# EAGLE design MCU_Power_PCB_Rev1 (EAGLE 9.6.2)
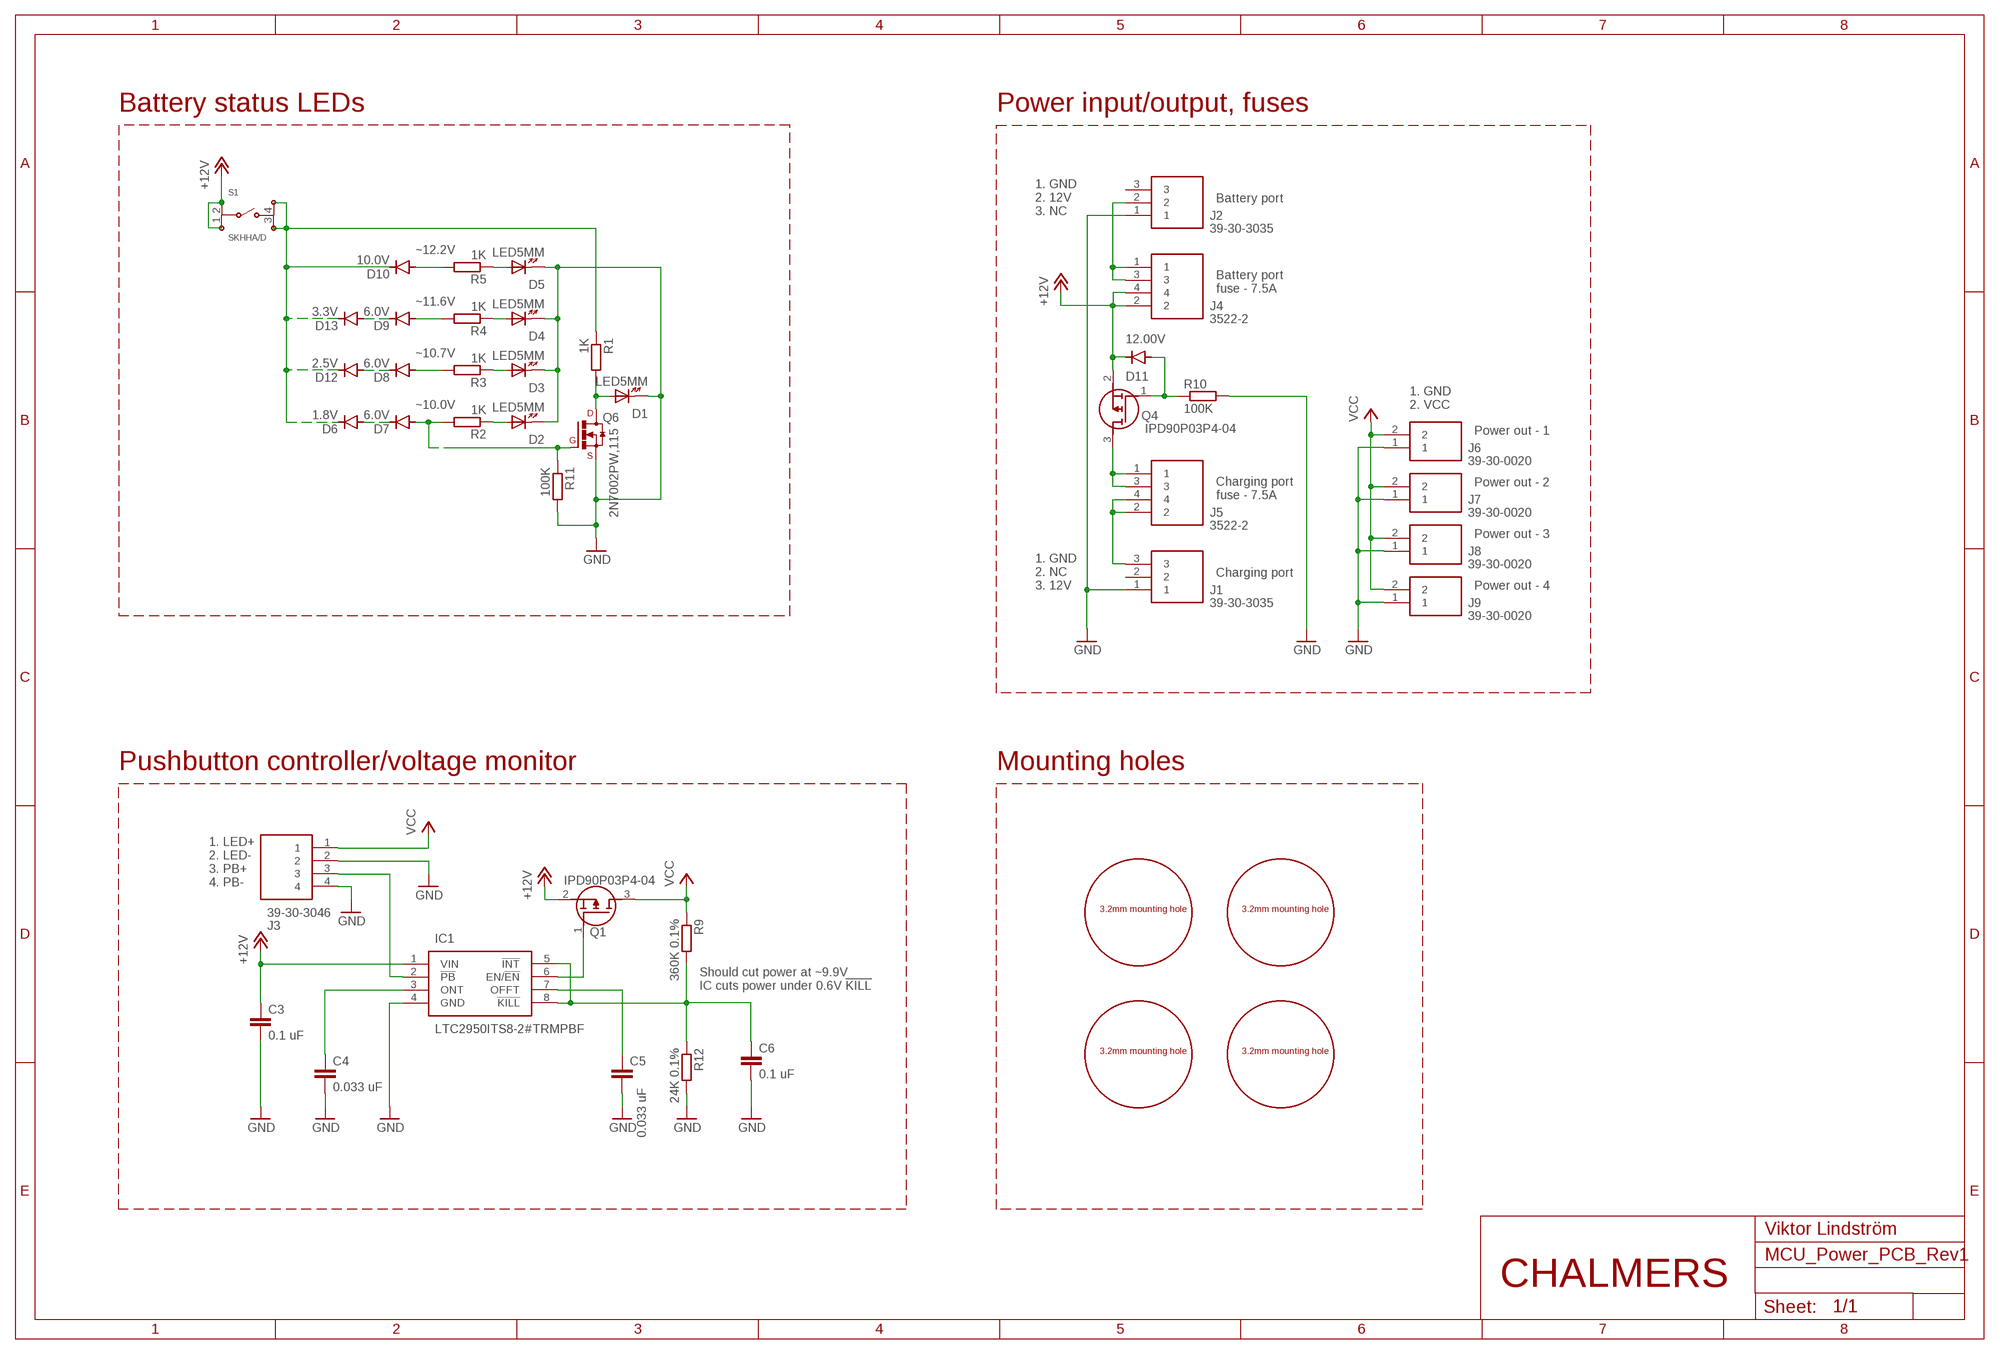
[diagram p0: schematic, sheet 1]

## Parts
C3  0.1 uF  C0603  [C0603]
C4  0.033 uF  C0603  [C0603]
C5  0.033 uF  C0603  [C0603]
C6  0.1 uF  C0603  [C0603]
D1  LED5MM  [LED5MM]
D2  LED5MM  [LED5MM]
D3  LED5MM  [LED5MM]
D4  LED5MM  [LED5MM]
D5  LED5MM  [LED5MM]
D6  1.8V  CGRM4001-G  [SOD-123_MINI-SMA]
D7  6.0V  CGRM4001-G  [SOD-123_MINI-SMA]
D8  6.0V  CGRM4001-G  [SOD-123_MINI-SMA]
D9  6.0V  CGRM4001-G  [SOD-123_MINI-SMA]
D10  10.0V  CGRM4001-G  [SOD-123_MINI-SMA]
D11  12.00V  CGRM4001-G  [SOD-123_MINI-SMA]
D12  2.5V  CGRM4001-G  [SOD-123_MINI-SMA]
D13  3.3V  CGRM4001-G  [SOD-123_MINI-SMA]
HOLE1  M3_MOUNTING_HOLE  [M3_MOUNTING_HOLE]
HOLE2  M3_MOUNTING_HOLE  [M3_MOUNTING_HOLE]
HOLE3  M3_MOUNTING_HOLE  [M3_MOUNTING_HOLE]
HOLE4  M3_MOUNTING_HOLE  [M3_MOUNTING_HOLE]
IC1  LTC2950ITS8-2#TRMPBF  [SOT65P280X100-8N]
J1  39-30-3035  [39303035]
J2  39-30-3035  [39303035]
J3  39-30-3046  [39303046]
J4  3522-2  [35222]
J5  3522-2  [35222]
J6  39-30-0020  [39-30-1020_1]
J7  39-30-0020  [39-30-1020_1]
J8  39-30-0020  [39-30-1020_1]
J9  39-30-0020  [39-30-1020_1]
Q1  IPD90P03P4-04  [PG-TO252-3-11]
Q4  IPD90P03P4-04  [PG-TO252-3-11]
Q6  2N7002PW,115  [SOT323]
R1  1K  R0603  [R0603]
R2  1K  R0603  [R0603]
R3  1K  R0603  [R0603]
R4  1K  R0603  [R0603]
R5  1K  R0603  [R0603]
R9  360K 0.1%  R0603  [R0603]
R10  100K  R0603  [R0603]
R11  100K  R0603  [R0603]
R12  24K 0.1%  R0603  [R0603]
S1  SKHHA/D  [SKHHA/D]

## Nets
+12V: C3.1 D11.C IC1.1(VIN) J4.2 J4.4 Q1.2(S) Q4.2(S) S1.1 S1.2
GND: C3.2 C4.2 C5.2 C6.2 D1.K D2.K D3.K D4.K D5.K IC1.4(GND) J1.1 J2.1 J3.2 J3.4 J6.1 J7.1 J8.1 J9.1 Q6.2(S) R10.2 R11.2 R12.2
N$1: J5.1 J5.3 Q4.3(D)
N$2: C4.1 IC1.3(ONT)
N$3: D2.A R2.1
N$4: D7.A Q6.1(G) R2.2 R11.1
N$5: D8.A R3.2
N$6: D9.A R4.2
N$7: D10.A R5.2
N$8: D3.A R3.1
N$9: D4.A R4.1
N$10: D5.A R5.1
N$11: IC1.2(!PB) J3.3
N$12: D1.A Q6.3(D) R1.2
N$14: J2.2 J4.1 J4.3
N$15: D6.A D7.C
N$16: D6.C D10.C D12.C D13.C R1.1 S1.3 S1.4
N$17: C5.1 IC1.7(OFFT)
N$18: J1.3 J5.2 J5.4
N$19: D8.C D12.A
N$20: D11.A Q4.1(G) R10.1
N$21: D9.C D13.A
N$24: C6.1 IC1.5(!INT) IC1.8(!KILL) R9.2 R12.1
N$25: IC1.6(EN/!EN) Q1.1(G)
VCC: J3.1 J6.2 J7.2 J8.2 J9.2 Q1.3(D) R9.1
Unconnected: J1.2 J2.3

## Notes on the sheet
- Battery status LEDs | Power input/output, fuses
- Battery port
- 1. GND
  2. 12V
  3. NC
- ~12.2V
- Battery port
  fuse - 7.5A
- ~11.6V
- ~10.7V
- ~10.0V
- 1. GND
  2. VCC
- Power out - 1
- Power out - 2
- Charging port
  fuse - 7.5A
- Power out - 3
- Charging port
- 1. GND
  2. NC
  3. 12V
- Power out - 4
- Pushbutton controller/voltage monitor | Mounting holes
- 1. LED+
  2. LED-
  3. PB+
  4. PB-
- Should cut power at ~9.9V
  IC cuts power under 0.6V !KILL
- Viktor Lindström
- CHALMERS

## Library data of the parts
C3-C6 = CASE-RCL:C0603: Standard Chip CAPACITOR 0605 (1608 Metric) Description: Standard Chip CAPACITOR 0605 (1608 Metric)
D1-D5 = CASE-LED:LED5MM: LED 5mm (TH) Description: Standard 5mm TH LED
D6-D13 = diode:CGRM400*-G: Molded plasitc,JEDEC SOD-123/Mini SMA Source: Comchip CGRM4001-G.pdf
HOLE1-HOLE4 = RescueRunner:M3_MOUNTING_HOLE
IC1 = LTC2950ITS8-2#TRMPBF:LTC2950ITS8-2#TRMPBF: Linear Technology LTC2950ITS8-2#TRMPBF, Voltage Controller 1V max., 8-Pin TSOT-23 Source: Datasheet <http://uk.rs-online.com/web/p/products/8225976P>; DESCRIPTION: Linear Technology LTC2950ITS8-2#TRMPBF, Voltage Controller 1V max., 8-Pin TSOT-23; HEIGHT: 1mm; MANUFACTURER_NAME: Linear Technology; MANUFACTURER_PART_NUMBER: LTC2950ITS8-2#TRMPBF; RS_PART_NUMBER: 8225976P; RS_PRICE-STOCK: http://uk.rs-online.com/web/p/products/8225976P
J1 J2 = 39-30-3035:39-30-3035: Molex Mini-Fit Jr 5569, 3 Way, 1 Row, Right Angle PCB Header Source: Datasheet <http://uk.rs-online.com/web/p/products/6705849P>; ALLIED_NUMBER: 70266945; DESCRIPTION: Molex Mini-Fit Jr 5569, 3 Way, 1 Row, Right Angle PCB Header; HEIGHT: 5.8mm; MANUFACTURER_NAME: Molex; MANUFACTURER_PART_NUMBER: 39-30-3035; RS_PART_NUMBER: 6705849P; RS_PRICE-STOCK: http://uk.rs-online.com/web/p/products/6705849P
J3 = 39-30-3046:39-30-3046: Molex MINI-FIT JR. Series, Series Number 5569, 4.2mm Pitch 4 Way 1 Row Right Angle PCB Header, Solder Termination, 12A Source: Datasheet <http://uk.rs-online.com/web/p/products/6705859P>; ALLIED_NUMBER: 70374137; DESCRIPTION: Molex MINI-FIT JR. Series, Series Number 5569, 4.2mm Pitch 4 Way 1 Row Right Angle PCB Header, Solder Termination, 12A; HEIGHT: 6.18mm; MANUFACTURER_NAME: Molex; MANUFACTURER_PART_NUMBER: 39-30-3046; RS_PART_NUMBER: 6705859P; RS_PRICE-STOCK: http://uk.rs-online.com/web/p/products/6705859P
J4 J5 = 3522-2:3522-2: Double ATO 257 fuseholder,15A 500Vac Keystone 15A PCB Mount Fuse Holder for 5.2 x 0.64mm Automotive Fuse, 500 V ac Source: Datasheet <http://uk.rs-online.com/web/p/products/1676068>; ALLIED_NUMBER: 70181615; DESCRIPTION: Double ATO 257 fuseholder,15A 500Vac Keystone 15A PCB Mount Fuse Holder for 5.2 x 0.64mm Automotive Fuse, 500 V ac; HEIGHT: 8mm; MANUFACTURER_NAME: Keystone Electronics; MANUFACTURER_PART_NUMBER: 3522-2; RS_PART_NUMBER: 1676068; RS_PRICE-STOCK: http://uk.rs-online.com/web/p/products/1676068
J6-J9 = 39-30-0020:39-30-0020: MOLEX - 39-30-0020 - HEADER, MINI-FIT, R/A, DUAL ROW, 2WAY Source: Datasheet <http://uk.rs-online.com/web/p/products/6705708P>; ALLIED_NUMBER: 70266919; DESCRIPTION: MOLEX - 39-30-0020 - HEADER, MINI-FIT, R/A, DUAL ROW, 2WAY; HEIGHT: mm; MANUFACTURER_NAME: Molex; MANUFACTURER_PART_NUMBER: 39-30-0020; RS_PART_NUMBER: 6705708P; RS_PRICE-STOCK: http://uk.rs-online.com/web/p/products/6705708P
Q1 Q4 = IPD90P03P4-04:IPD90P03P4-04: MOSFET P-Channel 30V 90A TO252-3 Infineon IPD90P03P4-04 P-channel MOSFET Transistor, 90 A, 30 V, 3-Pin TO-252 Source: Datasheet <https://www.infineon.com/dgdl/Infineon-IPD90P03P4_04-DS-v01_00-en.pdf?fileId=db3a30431ddc9372011e07ecafdb27ed>; DESCRIPTION: MOSFET P-Channel 30V 90A TO252-3 Infineon IPD90P03P4-04 P-channel MOSFET Transistor, 90 A, 30 V, 3-Pin TO-252; HEIGHT: mm; MANUFACTURER_NAME: Infineon; MANUFACTURER_PART_NUMBER: IPD90P03P4-04
Q6 = CASE-Transistors:2N7002PW,115: 2N7002PW,115 N-Channel Mosfet (SOT-323) Description: 2N7002PW,115 N-Channel Mosfet in a SOT-323 (SC-70) package Links: 2N7002PW,115 <http://www.farnell.com/datasheets/1760698.pdf?_ga=2.3009012.510093211.1546607516-411290609.1543318711>
R1-R5 R9-R12 = CASE-RCL:R0603: Standard Chip RESISTOR 0603 (1608 Metric) Description: Standard Chip RESISTOR 0603 (1608 Metric)
S1 = CASE-Switches:SKHHA/D: ALPS SKHHA/D Tactile SPST switches (DIP) Description: ALPS SKHHA/D Tactile SPST switches in DIP package. Links: SKHHAJA010 <http://www.farnell.com/datasheets/1685516.pdf?_ga=2.249631877.2071720333.1546461288-1112771566.1525371275> SKHHARA010 <http://www.farnell.com/datasheets/1685516.pdf?_ga=2.249631877.2071720333.1546461288-1112771566.1525371275> SKHHAPA010 <http://www.farnell.com/datasheets/1582298.pdf?_ga=2.236523650.2071720333.1546461288-1112771566.1525371275> SKHHDUA010 <http://www.farnell.com/datasheets/1582310.pdf?_ga=2.236523650.2071720333.1546461288-1112771566.1525371275>

## Board
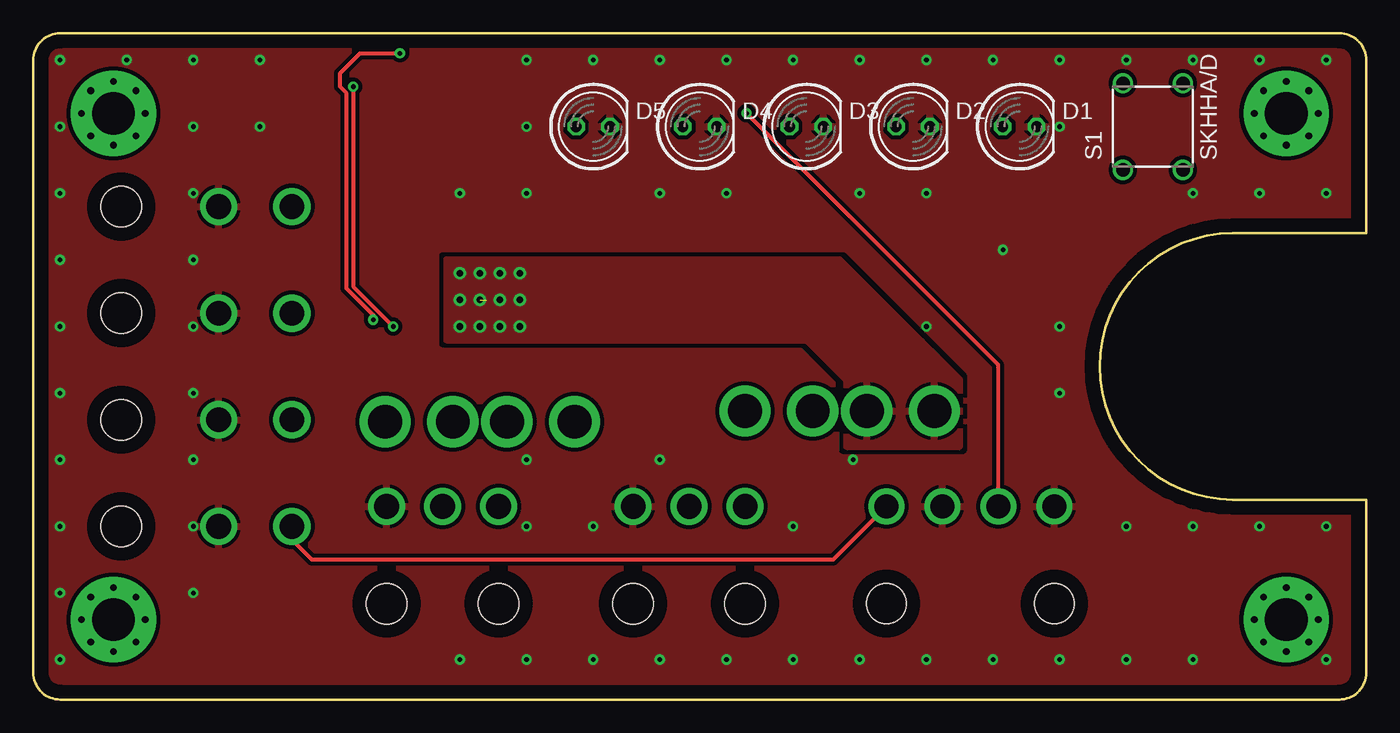
[diagram p1: board, top side]
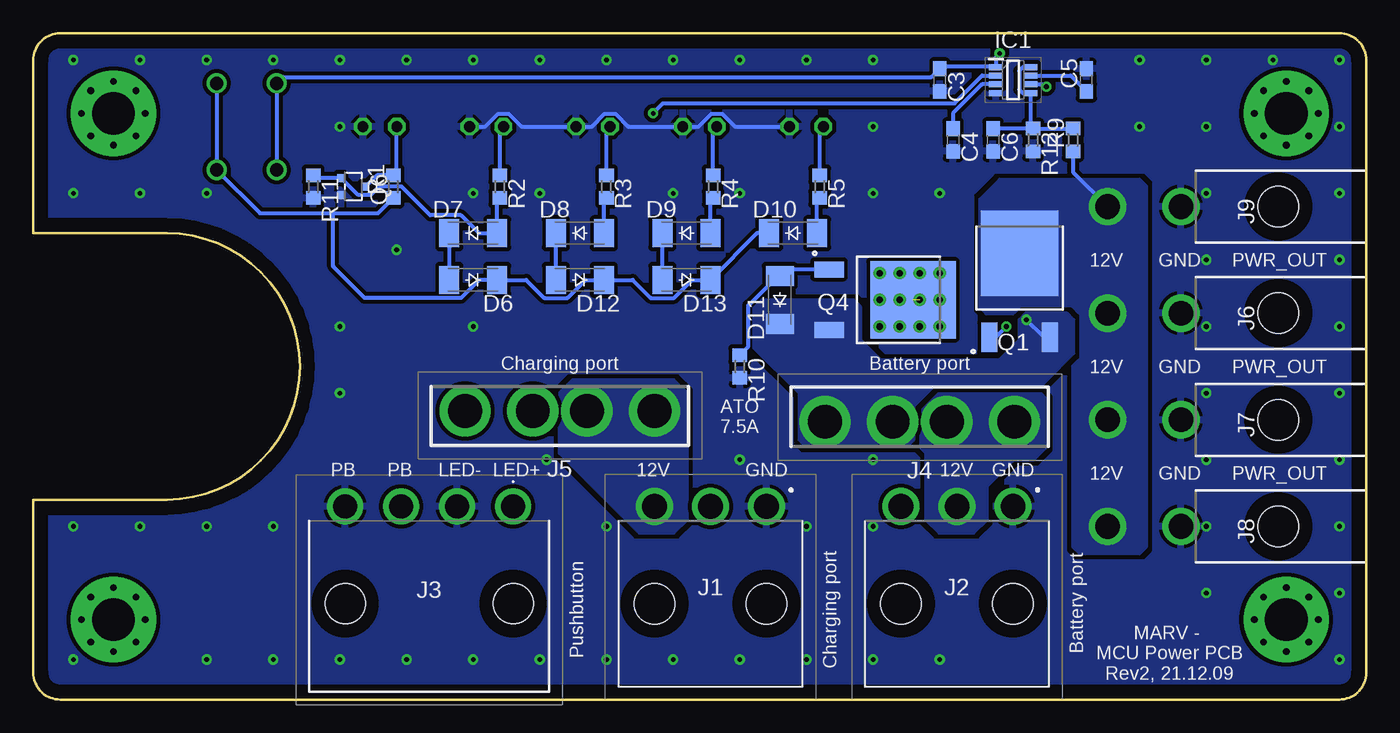
[diagram p2: board, bottom side, seen from below]

Size 100 x 50 mm. Coordinates in mm from the lower left corner, seen from the top.
Outline: 0,2 arc90 2,0 98,0 arc90 100,2 100,15 90,15 arc-180 90,35 100,35 100,48 arc90 98,50 2,50 arc90 0,48 0,2
Copper layers (1*16): Top 0.035mm / dielectric 1.5mm / Bottom 0.035mm
Design rules "default": minimum track width 6mil, minimum drill 0.35mm, track to track 6mil, track to pad 6mil, pad to pad 6mil, via to via 6mil, smd to smd 6mil, copper to edge 40mil, drill to drill 6mil, minimum pad ring 10mil, minimum via ring 8mil, stop-mask expansion 4mil, vias tented up to drill 0mil, thermal gap 10mil

### Footprints (pad centres in the part's own frame; a part is rotated, then mirrored left to right if it is on the bottom)
C0603 = smd 1.1 x 1: 1 -0.85,0; 2 0.85,0
LED5MM = drill 0.813 octagon: A -1.27,0; K 1.27,0
SOD-123_MINI-SMA = smd 1.5 x 2.1: A 1.8,0; C -1.8,0
M3_MOUNTING_HOLE = drill 0.5 pad 0.8: P$1 -2.4,0; P$2 0,2.4; P$3 2.4,0; P$4 0,-2.4; P$5 -1.697,1.697; P$6 1.697,1.697; P$7 1.697,-1.697; P$8 -1.697,-1.697 | drill 3.2 pad 6.4: P$10 0,0
SOT65P280X100-8N = smd 1.05 x 0.45: 1 -1.3,0.975; 2 -1.3,0.325; 3 -1.3,-0.325; 4 -1.3,-0.975; 5 1.3,-0.975; 6 1.3,-0.325; 7 1.3,0.325; 8 1.3,0.975
39303035 = drill 1.85 pad 2.775: 1 0,0; 2 -4.2,0; 3 -8.4,0 | hole 3.05: -8.4,-7.3; 0,-7.3
39303046 = drill 1.8 pad 2.7: 1 0,0; 2 -4.2,0; 3 -8.4,0; 4 -12.6,0 | hole 3: -12.6,-7.3; 0,-7.3
35222 = drill 2.54 pad 3.84: 1 -7.11,-1.85; 2 7.11,-1.85; 3 -2.03,-1.85; 4 2.03,-1.85
39-30-1020_1 = drill 1.85 pad 2.8: 1 0,13.9; 2 0,19.4 | hole 3.05: 0,6.6
PG-TO252-3-11 = smd 1.2 x 2.2: 1 -2.28,-8.3; 2 2.28,-8.3 | smd 5.8 x 6.4: 3 0,-2
SOT323 = smd 0.6 x 0.55: 1 -0.65,-0.925; 2 0.65,-0.925; 3 0,0.925
R0603 = smd 1 x 1.1: 1 -0.85,0; 2 0.85,0
SKHHA/D = drill 1 pad 1.5: 1 -2.25,-3.25; 2 -2.25,3.25; 3 2.25,-3.25; 4 2.25,3.25

### Placement (x,y rotation side)
C3  32,46.5 270 bottom
C4  31,42 270 bottom
C5  21,46.5 90 bottom
C6  28,42 270 bottom
D1  74,43 0 top
D2  66,43 0 top
D3  58,43 0 top
D4  50,43 0 top
D5  42,43 0 top
D6  67,31.5 180 bottom
D7  67,35 0 bottom
D8  59,35 0 bottom
D9  51,35 0 bottom
D10  43,35 0 bottom
D11  44,30 90 bottom
D12  59,31.5 180 bottom
D13  51,31.5 180 bottom
HOLE1  94,6 0 top
HOLE2  94,44 0 top
HOLE3  6,6 0 top
HOLE4  6,44 0 top
IC1  26.5,46.5 0 bottom
J1  45,14.5 0 bottom
J2  26.5,14.5 0 bottom
J3  64,14.5 0 bottom
J4  33.5,19 180 bottom
J5  60.5,23.5 0 bottom
J6  0,29 90 bottom
J7  0,21 90 bottom
J8  0,13 90 bottom
J9  0,37 90 bottom
Q1  26,35.5 0 bottom
Q4  32,30 270 bottom
Q6  76,38.5 270 bottom
R1  73,38.5 90 bottom
R2  65,38.5 270 bottom
R3  57,38.5 270 bottom
R4  49,38.5 270 bottom
R5  41,38.5 270 bottom
R9  22,42 90 bottom
R10  47,25 270 bottom
R11  79,38.5 270 bottom
R12  25,42 270 bottom
S1  84,43 0 top

### Tracks (layer width: path | path; a pad name or v marks a point on that pad's centre or on a via)
+12V  (via drill 0.35)
  Top 0.3: v25.5,28.5 25.5,28.86 23.5,30.86 23.5,45.5 23,46 23,47 24.5,48.5 v27.5,48.5
  Bottom 0.3: Q1.2 24.2,27.2 v25.5,28.5 | v27.5,48.5 27.8,48.2 IC1.1 31.88,47.48 C3.1 32.64,46.72 81.28,46.72 S1.2 S1.1
  pour Bottom (no thermals): 38,29 38,27 37.5,26.5 36.5,25.5 29.5,25.5 27.5,25.5 26,27 26,28.5 25.5,29 22.5,29 22,28.5 22,27.5 22,26 24,24 24.5,23.5 32.5,23.5 34,22 34,19.5 34.5,19 42,19 42.5,19.5 42.5,23 46,26.5 46,29.5 45.5,30 39.5,30 38.5,30 38,29.5
GND  (via drill 0.35)
  Bottom 0.3: D2.K 66.09,43 65.13,43.96 64.33,43.96 63.37,43 D3.K 58.09,43 57.13,43.96 56.33,43.96 55.37,43 D4.K 50.09,43 49.13,43.96 48.33,43.96 47.37,43 D5.K
  other vias: 2,48 7,48 12,48 17,48 37,48 42,48 47,48 52,48 57,48 62,48 67,48 72,48 77,48 82,48 87,48 92,48 97,48 97,38 97,13 97,3 87,3 82,3 77,3 72,3 67,3 62,3 57,3 47,3 52,3 42,3 37,3 32,3 2,3 2,8 2,13 2,18 2,23 2,28 2,33 2,38 37,38 67,28 67,38 62,38 52,38 47,38 77,23 77,28 82,13 12,23 12,28 12,33 12,38 12,18 12,13 12,8 12,43 2,43 37,43 32,38 42,13 37,13 57,13 47,18 61.5,18 37,18 17,43 92,38 92,13 87,13 87,38 77,43 72.75,33.75
  pour Top (isolate 0.305, rank 2): -1,51 100,51 100,-1 -0.5,-1
  pour Bottom (isolate 0.305, rank 3): -2,51 100,51 100,-1 -1.5,-1
N$1  (via drill 0.5)  (1 unrouted)
  other vias: 32,28 33.5,28 35,28 36.5,28 35,32 33.5,32 32,32 36.5,32 32,30 33.5,30 35,30 36.5,30
  pour Top: 31,27 58,27 61,24 61,19 69.5,19 69.5,24 60.5,33 31,33
N$2
  Bottom 0.3: IC1.3 28.82,46.17 31,44 C4.1
N$3
  Bottom 0.3: R2.1 65,42.73 D2.A
N$4
  Bottom 0.3: R2.2 65.2,37.45 D7.A 66.57,35 67.92,36.35 70.22,36.35 72.37,38.5 74.07,38.5 74.67,37.9 75.67,37.9 Q6.1 78.8,39.15 R11.1
N$5
  Bottom 0.3: D8.A 57.2,37.45 R3.2
N$6
  Bottom 0.3: D9.A 49.2,37.45 R4.2
N$7
  Bottom 0.3: D10.A 41.2,37.45 R5.2
N$8
  Bottom 0.3: R3.1 57,42.73 D3.A
N$9
  Bottom 0.3: R4.1 49,42.73 D4.A
N$10
  Bottom 0.3: R5.1 41,42.73 D5.A
N$11  (via drill 0.35)
  Top 0.3: J3.3 72.4,25.1 v53.5,44
  Bottom 0.3: v53.5,44 52.75,44.75 30.89,44.75 28.82,46.83 IC1.2
N$12
  Bottom 0.3: D1.A 72.73,39.62 R1.2 74.22,39.35 Q6.3
N$14
  pour Bottom (isolate 0.305, rank 2, no thermals): 32,12.5 33,13.5 33,14.5 33,18.5 34,19.5 34,22 32.5,23.5 25,23.5 24.5,23 24,22.5 24,19 24.5,18.5 25,18 26.5,18 28.5,16 28.5,14 28.5,13.5 29.5,12.5
N$15
  Bottom 0.3: D7.C D6.A
N$16
  Bottom 0.3: S1.4 S1.3 83,36.5 77.5,36.5 | R1.1 74.15,36.5 77.5,36.5 | 77.5,36.5 77.5,32.5 75.15,30.15 67.92,30.15 66.57,31.5 D6.C 63.03,31.5 61.67,30.15 59.92,30.15 58.57,31.5 D12.C 55.03,31.5 53.67,30.15 51.92,30.15 50.57,31.5 D13.C 45.7,35 D10.C
N$17
  Bottom 0.3: IC1.7 22.18,46.83 C5.1
N$18
  pour Bottom (isolate 0.305, no thermals): 53.5,12.5 54.5,12.5 60.5,18.5 60.5,19.5 60.5,23 59.5,24 52,24 51,23 51,13.5 52,12.5
N$19
  Bottom 0.3: D12.A D8.C
N$20
  Bottom 0.3: Q4.1 43.52,32.28 D11.A 44.13,31.8 46.35,29.57 46.35,26.5 R10.1
N$21
  Bottom 0.3: D13.A D9.C
N$24
  Bottom 0.3: R12.1 C6.1 | R12.1 R9.2 | IC1.8 25.73,47.48 26.03,47.17 26.03,45.78 25.75,45.5 25.23,45.5 IC1.5 25.2,43.05 R12.1
N$25  (via drill 0.35)
  Top 0.3: v27,28 24,31 v24,46
  Bottom 0.3: IC1.6 24.18,46.17 v24,46 | v27,28 27.8,27.2 Q1.1
VCC
  Top 0.3: J3.1 60,10.5 20.9,10.5 19.4,12 J8.2
  Bottom 0.3: R9.1 22,39.6 J9.2
  Bottom 4: Q1.3 25.5,33
  pour Bottom (isolate 0.305, rank 2, no thermals): 22,29 22,11.5 21.5,11 17,11 16.5,11.5 16.5,38.5 17,39 27.5,39 29,37.5 29,29.5 28.5,29

### Text on the board
bPlace: PWR_OUT | GND | 12V | PWR_OUT | GND | 12V | Battery port | Charging port | ATO / 7.5A | PWR_OUT | GND | 12V | GND | 12V | GND | 12V | LED+ | LED- | PB | PB | Battery port | Charging port | Pushbutton | MARV - / MCU Power PCB / Rev2, 21.12.09